# EAGLE design almost_smart_thermostat_v01 (EAGLE 8.7.0)
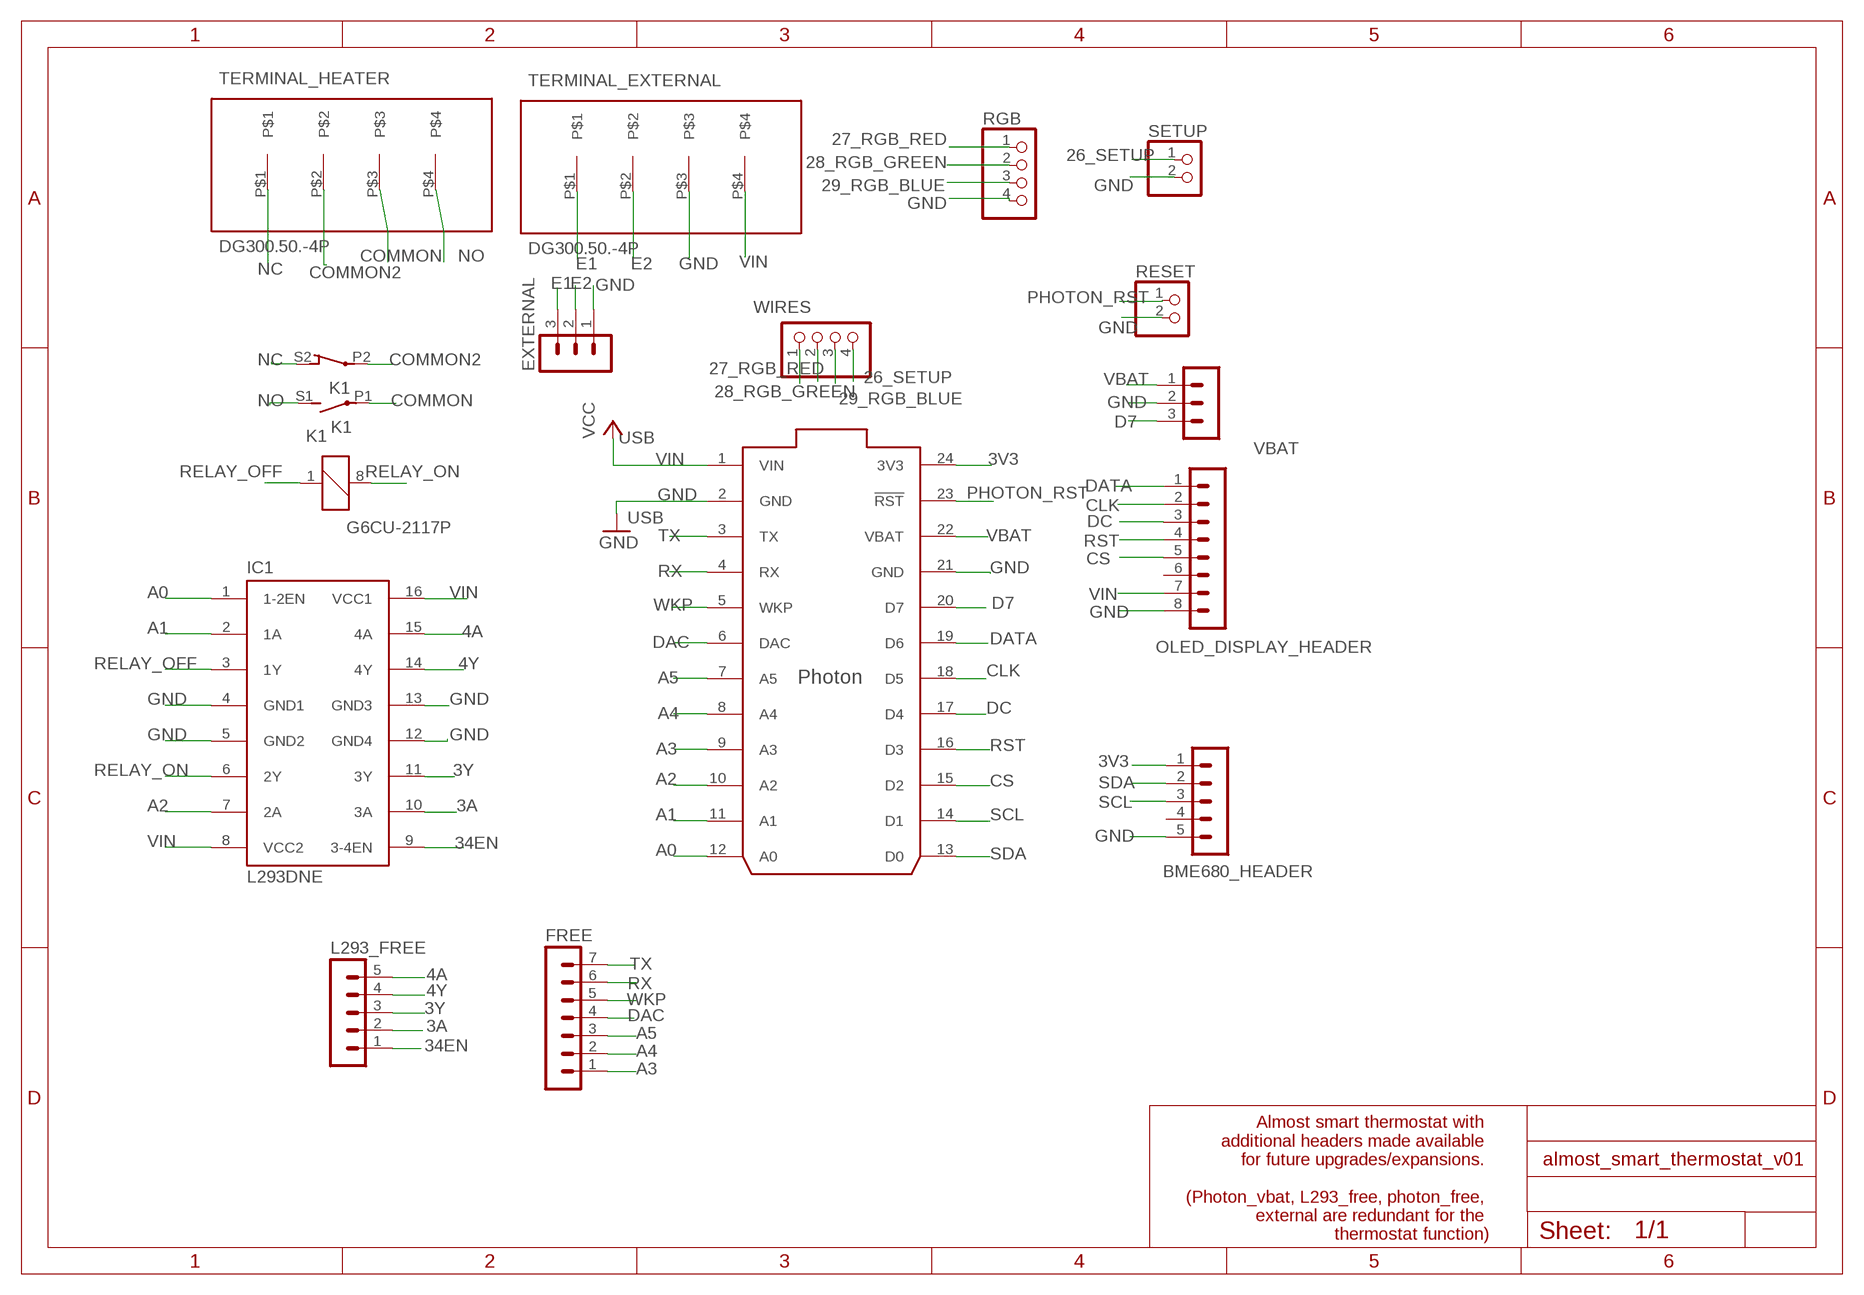
[diagram p0: schematic, sheet 1]

## Parts
BME680_HEADER  MA05-1  [MA05-1]
EXTERNAL  MA03-1  [MA03-1]
FREE  MA07-1  [MA07-1]
IC1  L293DNE  L293D  [DIL16]
K1  G6CU-2117P  G6C-2117P  [G6C-2117P]
L293_FREE  MA05-1  [MA05-1]
OLED_DISPLAY_HEADER  MA08-1  [MA08-1]
RESET  PINHD-1X2  [1X02]
RGB  PINHD-1X4  [1X04]
SETUP  PINHD-1X2  [1X02]
TERMINAL_EXTERNAL  DG300.50.-4P  [DG300-5.0-4P]
TERMINAL_HEATER  DG300.50.-4P  [DG300-5.0-4P]
U$1  PHOTON_WITH_HEADERS  [PHOTON]
VBAT  MA03-1  [MA03-1]
WIRES  PINHD-1X4  [1X04]

## Nets
3A: IC1.10(3A) L293_FREE.2
3V3: BME680_HEADER.1 U$1.24(3V3)
3Y: IC1.11(3Y) L293_FREE.3
4A: IC1.15(4A) L293_FREE.5
4Y: IC1.14(4Y) L293_FREE.4
26_SETUP: SETUP.1 WIRES.4
27_RGB_RED: RGB.1 WIRES.1
28_RGB_GREEN: RGB.2 WIRES.2
29_RGB_BLUE: RGB.3 WIRES.3
34EN: IC1.9(3-4EN) L293_FREE.1
A0: IC1.1(1-2EN) U$1.12(A0)
A1: IC1.2(1A) U$1.11(A1)
A2: IC1.7(2A) U$1.10(A2)
A3: FREE.1 U$1.9(A3)
A4: FREE.2 U$1.8(A4)
A5: FREE.3 U$1.7(A5)
CLK: OLED_DISPLAY_HEADER.2 U$1.18(D5)
COMMON: K1.P1(2:P) TERMINAL_HEATER.P$3
COMMON2: K1.P2(3:P) TERMINAL_HEATER.P$2
CS: OLED_DISPLAY_HEADER.5 U$1.15(D2)
D7: U$1.20(D7) VBAT.3
DAC: FREE.4 U$1.6(DAC)
DATA: OLED_DISPLAY_HEADER.1 U$1.19(D6)
DC: OLED_DISPLAY_HEADER.3 U$1.17(D4)
E1: EXTERNAL.3 TERMINAL_EXTERNAL.P$1
E2: EXTERNAL.2 TERMINAL_EXTERNAL.P$2
GND: BME680_HEADER.5 EXTERNAL.1 IC1.4(GND1) IC1.5(GND2) IC1.12(GND4) IC1.13(GND3) OLED_DISPLAY_HEADER.8 RESET.2 RGB.4 SETUP.2 TERMINAL_EXTERNAL.P$3 U$1.2(GND) U$1.21(GND) VBAT.2
NC: K1.S2(3:O) TERMINAL_HEATER.P$1
NO: K1.S1(2:S) TERMINAL_HEATER.P$4
PHOTON_RST: RESET.1 U$1.23(!RST)
RELAY_OFF: IC1.3(1Y) K1.1
RELAY_ON: IC1.6(2Y) K1.8
RST: OLED_DISPLAY_HEADER.4 U$1.16(D3)
RX: FREE.6 U$1.4(RX)
SCL: BME680_HEADER.3 U$1.14(D1)
SDA: BME680_HEADER.2 U$1.13(D0)
TX: FREE.7 U$1.3(TX)
VBAT: U$1.22(VBAT) VBAT.1
VIN: IC1.8(VCC2) IC1.16(VCC1) OLED_DISPLAY_HEADER.7 TERMINAL_EXTERNAL.P$4 U$1.1(VIN) ; supply symbol labelled VCC
WKP: FREE.5 U$1.5(WKP)
Unconnected: BME680_HEADER.4 OLED_DISPLAY_HEADER.6

## Notes on the sheet
- USB
- USB
- Almost smart thermostat with 
  additional headers made available 
  for future upgrades/expansions. 
  
  (Photon_vbat, L293_free, photon_free, 
  external are redundant for the 
  thermostat function)

## Library data of the parts
BME680_HEADER L293_FREE = con-lstb:MA05-1: PIN HEADER; OC_FARNELL: unknown; OC_NEWARK: unknown
EXTERNAL VBAT = con-lstb:MA03-1: PIN HEADER; OC_FARNELL: unknown; OC_NEWARK: unknown
FREE = con-lstb:MA07-1: PIN HEADER; OC_FARNELL: unknown; OC_NEWARK: unknown
IC1 = st-microelectronics:L293D: PUSH-PULL 4 CHANNEL DRIVER
K1 = relay:G6C-2117P: RELAY 1 x norm. open, 1x norm. closed, 10 A/240 V, Omron; OC_FARNELL: unknown; OC_NEWARK: unknown
OLED_DISPLAY_HEADER = con-lstb:MA08-1: PIN HEADER; OC_FARNELL: unknown; OC_NEWARK: unknown
RESET SETUP = pinhead:PINHD-1X2: PIN HEADER
RGB WIRES = pinhead:PINHD-1X4: PIN HEADER
TERMINAL_EXTERNAL TERMINAL_HEATER = heksalab:DG300.50.-4P: Degson Electronics PCB Terminal block
U$1 = Particle:PHOTON

## Board
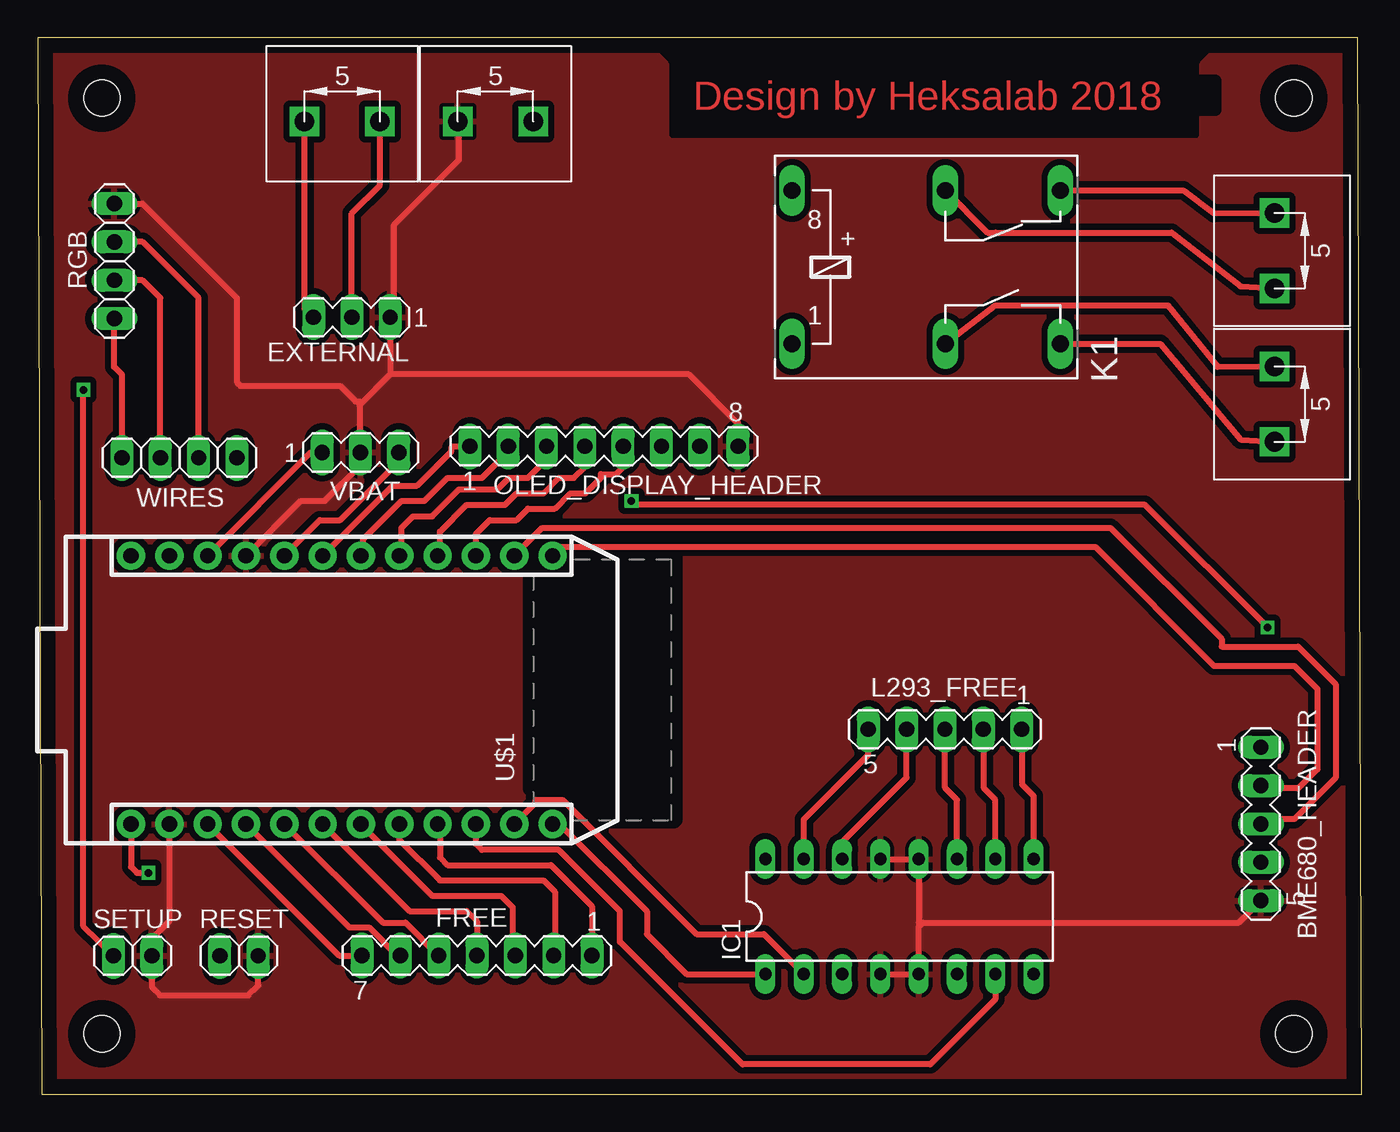
[diagram p1: board, top side]
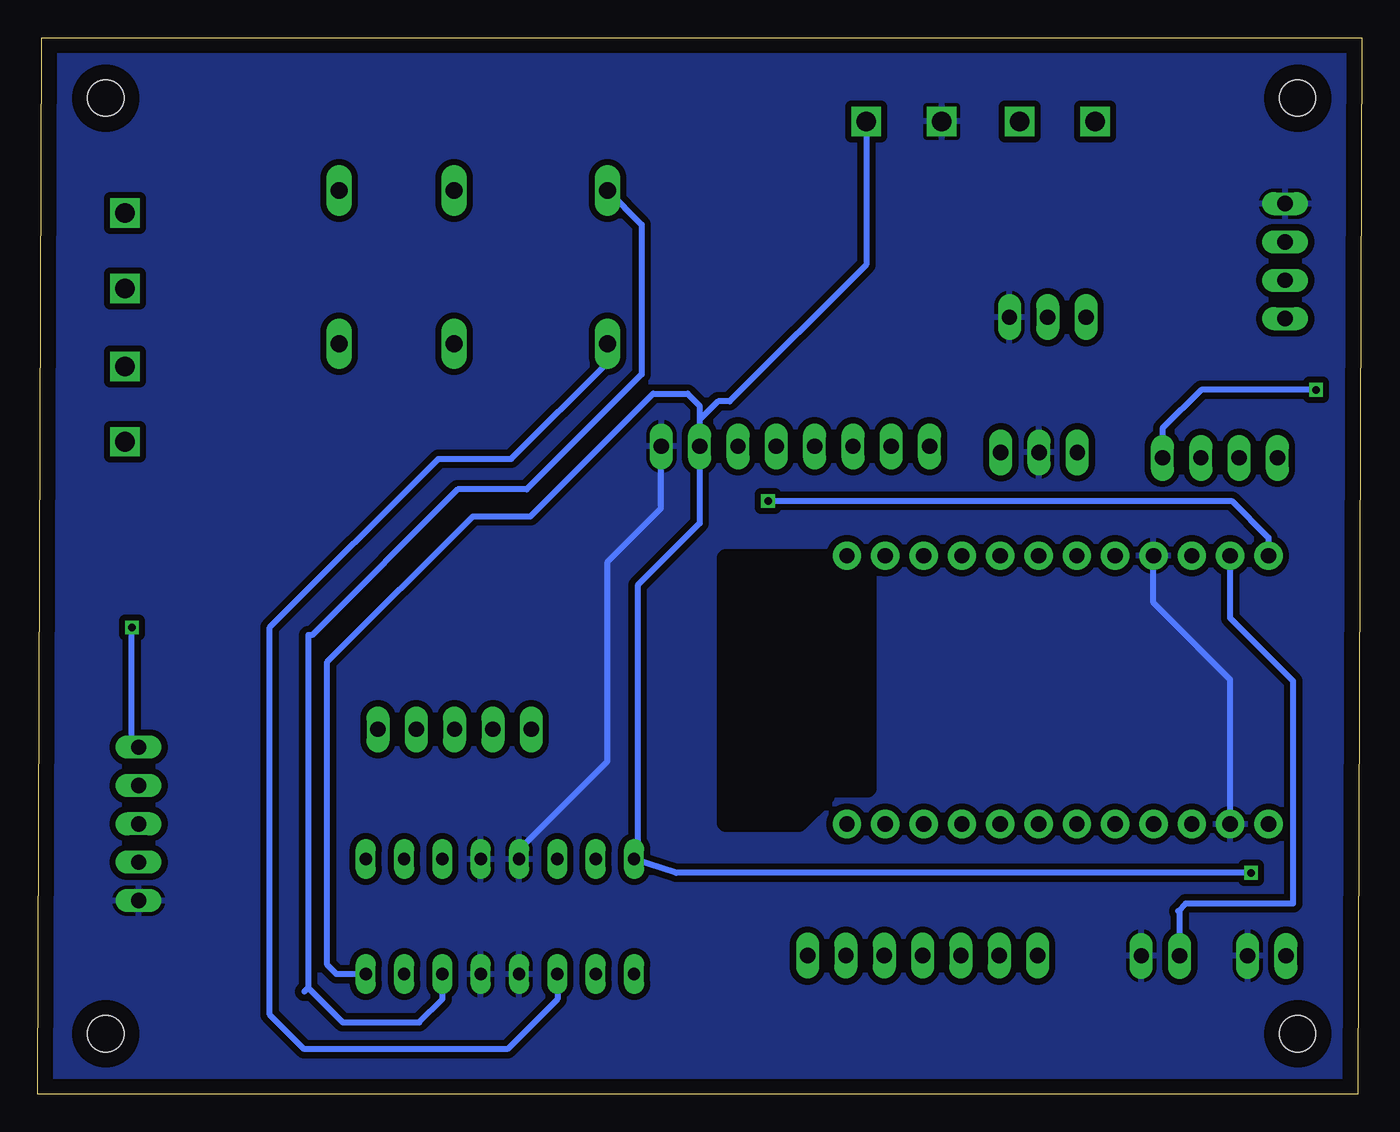
[diagram p2: board, bottom side, seen from below]

Size 87.76 x 70 mm. Coordinates in mm from the lower left corner, seen from the top.
Outline: 0.25,0 87.76,0 87.51,70 0,70 0.25,0
Copper layers (1*16): Top 0.035mm / dielectric 1.5mm / Bottom 0.035mm
Design rules "default": minimum track width 6mil, minimum drill 0.35mm, track to track 6mil, track to pad 6mil, pad to pad 6mil, via to via 6mil, smd to smd 6mil, copper to edge 40mil, drill to drill 6mil, minimum pad ring 10mil, minimum via ring 8mil, stop-mask expansion 4mil, vias tented up to drill 0mil, thermal gap 10mil
Holes 2.4 mm at 4.25,66 4.25,4 83.25,4 83.25,66
tRestrict: area 32.8,18 to 42.1,35.5
bRestrict: area 32.8,18 to 42.1,35.5

### Footprints (pad centres in the part's own frame; a part is rotated, then mirrored left to right if it is on the bottom)
MA05-1 = drill 1.016 long: 1 -5.08,0; 2 -2.54,0; 3 0,0; 4 2.54,0; 5 5.08,0
MA03-1 = drill 1.016 long: 1 -2.54,0; 2 0,0; 3 2.54,0
MA07-1 = drill 1.016 long: 1 -7.62,0; 2 -5.08,0; 3 -2.54,0; 4 0,0; 5 2.54,0; 6 5.08,0; 7 7.62,0
DIL16 = drill 0.813 long: 1 -8.89,-3.81; 2 -6.35,-3.81; 3 -3.81,-3.81; 4 -1.27,-3.81; 5 1.27,-3.81; 6 3.81,-3.81; 7 6.35,-3.81; 8 8.89,-3.81; 9 8.89,3.81; 10 6.35,3.81; 11 3.81,3.81; 12 1.27,3.81; 13 -1.27,3.81; 14 -3.81,3.81; 15 -6.35,3.81; 16 -8.89,3.81
G6C-2117P = drill 1.118 long: 1 -8.89,-5.08; 8 -8.89,5.08; P1 1.27,-5.08; P2 1.27,5.08; S1 8.89,-5.08; S2 8.89,5.08
MA08-1 = drill 1.016 long: 1 -8.89,0; 2 -6.35,0; 3 -3.81,0; 4 -1.27,0; 5 1.27,0; 6 3.81,0; 7 6.35,0; 8 8.89,0
1X02 = drill 1.016 long: 1 -1.27,0; 2 1.27,0
1X04 = drill 1.016 long: 1 -3.81,0; 2 -1.27,0; 3 1.27,0; 4 3.81,0
DG300-5.0-4P = drill 1.3 square: P$1 -6.31,1.5; P$2 -1.31,1.5; P$3 3.85,1.5; P$4 8.85,1.5
PHOTON = drill 1.016 pad 1.88: 1 1.27,32.258; 2 1.27,29.718; 3 1.27,27.178; 4 1.27,24.638; 5 1.27,22.098; 6 1.27,19.558; 7 1.27,17.018; 8 1.27,14.478; 9 1.27,11.938; 10 1.27,9.398; 11 1.27,6.858; 12 1.27,4.318; 13 19.05,4.318; 14 19.05,6.858; 15 19.05,9.398; 16 19.05,11.938; 17 19.05,14.478; 18 19.05,17.018; 19 19.05,19.558; 20 19.05,22.098; 21 19.05,24.638; 22 19.05,27.178; 23 19.05,29.718; 24 19.05,32.258

### Placement (x,y rotation side)
BME680_HEADER  81.07,17.91 270 top
EXTERNAL  20.81,51.48 180 top
FREE  29.11,9.18 180 top
IC1  57.12,11.77 0 top
K1  58.88,54.8 0 top
L293_FREE  60.13,24.18 180 top
OLED_DISPLAY_HEADER  37.53,42.93 0 top
RESET  13.34,9.17 0 top
RGB  5.08,55.2 90 top
SETUP  6.29,9.17 0 top
TERMINAL_EXTERNAL  23.99,62.96 0 top
TERMINAL_HEATER  80.47,52.08 270 top
U$1  38.44,16.63 90 top
VBAT  21.39,42.52 0 top
WIRES  9.39,42.17 0 top

### Tracks (layer width: path | path; a pad name or v marks a point on that pad's centre or on a via)
3A
  Top 0.406: IC1.10 63.47,19.5 62.72,20.26 62.72,24.13 L293_FREE.2
3V3  (via drill 0.5)
  Top 0.406: v81.52,30.92 73.39,39.05 39.61,39.05 v39.35,39.31
  Bottom 0.406: BME680_HEADER.1 81.52,23.43 v81.52,30.92 | v39.35,39.31 8.62,39.31 6.19,36.87 U$1.24
3Y
  Top 0.406: IC1.11 60.93,19.5 60.13,20.3 L293_FREE.3
4A
  Top 0.406: IC1.15 50.77,18.21 55.05,22.49 L293_FREE.5
4Y
  Top 0.406: IC1.14 53.31,16.69 57.59,20.97 L293_FREE.4
26_SETUP  (via drill 0.5)
  Top 0.406: SETUP.1 3.03,11.11 v3.03,46.67
  Bottom 0.406: v3.03,46.67 10.65,46.67 13.2,44.12 WIRES.4
27_RGB_RED
  Top 0.406: WIRES.1 5.58,47.68 5.06,48.2 5.06,51.37 RGB.1
28_RGB_GREEN
  Top 0.406: WIRES.2 8.12,52.76 6.95,53.93 RGB.2
29_RGB_BLUE
  Top 0.406: WIRES.3 10.66,52.76 6.95,56.47 RGB.3
34EN
  Top 0.406: IC1.9 66.01,19.76 65.26,20.51 65.26,24.13 L293_FREE.1
A0
  Top 0.406: U$1.12 34.6,17.9 40.37,12.13 40.37,10.6 43.01,7.96 IC1.1
A1
  Top 0.406: U$1.11 33,19.32 33,19.49 34.78,19.49 43.67,10.6 48.13,10.6 IC1.2
A2
  Top 0.406: IC1.7 63.47,6.28 59.17,1.97 46.72,1.97 38.59,10.1 38.59,12.13 34.53,16.19 29.45,16.19 29.05,16.59 U$1.10
A3
  Top 0.406: U$1.9 26.65,17.75 26.65,15.68 27.16,15.18 34.02,15.18 36.73,12.46 FREE.1
A4
  Top 0.406: 24.11,17.75 U$1.8 23.97,16.85 26.65,14.16 33.51,14.16 34.27,13.4 34.27,9.26 FREE.2
A5
  Top 0.406: 21.57,17.75 U$1.7 21.43,17.86 26.15,13.14 30.72,13.14 31.48,12.38 31.48,9.35 FREE.3
CLK
  Top 0.406: U$1.18 21.57,35.83 21.57,36.77 24.11,39.31 25.64,39.31 27.16,40.83 29.45,40.83 31.18,42.57 OLED_DISPLAY_HEADER.2
COMMON
  Top 0.406: K1.P1 63.48,52.26 74.91,52.26 78.22,48.2 TERMINAL_HEATER.P$3
COMMON2
  Top 0.406: TERMINAL_HEATER.P$2 79.74,53.53 75.17,57.09 63.48,57.09 62.98,57.09 62.95,57.09 K1.P2
CS
  Top 0.406: U$1.15 29.05,37.13 29.96,38.04 31.73,38.04 32.5,38.8 34.27,38.8 35.29,39.81 36.31,39.81 37.32,40.83 37.32,41.08 38.34,41.08 38.8,41.55 OLED_DISPLAY_HEADER.5
D7
  Top 0.406: U$1.20 18.7,38.04 20.05,38.04 24.37,42.35 24.2,42.52 VBAT.3
DAC
  Top 0.406: U$1.6 24.66,12.13 28.43,12.13 29.11,11.45 FREE.4
DATA
  Top 0.406: U$1.19 23.53,40.32 25.13,40.32 27.42,42.61 27.42,42.86 27.48,42.93 OLED_DISPLAY_HEADER.1
DC
  Top 0.406: U$1.17 24.11,35.83 24.11,37.53 24.88,38.29 26.15,38.29 27.92,40.07 30.46,40.07 31.23,40.83 32.5,40.83 33.77,42.1 33.77,42.89 OLED_DISPLAY_HEADER.3
E1
  Top 0.406: EXTERNAL.3 17.68,52.07 TERMINAL_EXTERNAL.P$1
E2
  Top 0.406: EXTERNAL.2 20.81,58.36 22.68,60.23 TERMINAL_EXTERNAL.P$2
GND
  Top 0.406: U$1.2 8.73,11.47 7.56,10.31 | 7.56,10.31 7.35,10.1 | RESET.2 14.61,7.2 13.95,6.54 8.11,6.54 7.56,7.09 SETUP.2 7.56,10.31 | U$1.21 17.43,39.31 19.03,39.31 21.39,41.67 VBAT.2 21.32,42.59 21.32,45.66 | RGB.4 6.95,59.01 13.19,52.77 13.19,47.18 13.45,46.93 20.05,46.93 21.07,45.91 21.32,45.91 21.32,45.66 | 23.35,47.69 EXTERNAL.1 23.61,51.73 23.61,57.59 27.92,61.91 27.92,64.38 TERMINAL_EXTERNAL.P$3 | 23.35,47.69 21.32,45.66 | OLED_DISPLAY_HEADER.8 46.42,44.43 43.16,47.69 23.35,47.69 | IC1.4 IC1.5 58.39,11.1 58.53,11.24 | 58.53,11.24 58.66,11.37 79.61,11.37 BME680_HEADER.5 | IC1.13 IC1.12 58.39,11.38 58.53,11.24
  Bottom 0.406: OLED_DISPLAY_HEADER.8 46.47,42.89 46.47,38.8 50.02,35.24 50.02,22.03 55.86,16.19 56.12,16.19 56.12,15.84 IC1.13 | U$1.2 8.73,27.47 13.81,32.55 U$1.21
  pour Top (isolate 0.406): 0.24,70.04 39.86,70.04 41.64,68.26 41.64,63.44 41.89,63.18 76.95,63.18 77.2,63.44 77.2,68.26 78.98,70.04 87.11,70.04 87.36,69.79 87.36,-0.06 0.24,-0.06
  pour Bottom (isolate 0.406): 0.24,70.04 87.36,70.04 87.36,0.19 87.11,-0.06 0.49,-0.06 0.24,0.19
NC
  Top 0.406: K1.S2 75.93,59.88 77.96,58.36 TERMINAL_HEATER.P$1
NO
  Top 0.406: K1.S1 74.41,49.72 79.74,43.37 TERMINAL_HEATER.P$4
PHOTON_RST
  Bottom 0.406: RESET.1 12.07,12.03 12.18,12.13 11.67,12.64 4.56,12.64 4.56,27.37 8.73,31.54 U$1.23
RELAY_OFF
  Bottom 0.406: IC1.3 53.31,6.3 56.63,2.98 70.09,2.98 72.37,5.27 72.37,30.92 61.2,42.1 56.37,42.1 49.99,48.48 K1.1
RELAY_ON
  Bottom 0.406: K1.8 47.74,57.62 47.74,47.69 55.36,40.07 59.93,40.07 69.58,30.42 69.83,30.42 69.83,7.05 | 70.09,6.79 69.83,7.05 | 69.83,7.05 67.55,4.76 62.47,4.76 60.93,6.3 IC1.6
RST
  Top 0.406: U$1.16 26.65,35.83 26.65,37.27 28.43,39.05 30.97,39.05 31.73,39.81 33.51,39.81 34.53,40.83 35.54,40.83 36.26,41.55 OLED_DISPLAY_HEADER.4
RX
  Top 0.406: U$1.4 20.65,11.06 21.96,11.06 23.84,9.18 FREE.6
SCL
  Top 0.406: U$1.14 33.43,37.53 71.1,37.53 78.47,30.16 78.47,29.65 83.55,29.65 86.04,27.17 86.04,20.96 83.3,18.22 81.52,18.22 81.2,17.91 BME680_HEADER.3
SDA
  Top 0.406: U$1.13 34.7,36.26 70.09,36.26 77.96,28.38 83.3,28.38 84.82,26.86 84.82,21.53 83.55,20.26 81.27,20.26 BME680_HEADER.2
TX
  Top 0.406: U$1.3 19.99,9.18 FREE.7
VBAT
  Top 0.406: U$1.22 18.11,42.52 VBAT.1
VIN  (via drill 0.5)
  Top 0.406: U$1.1 6.19,15.07 6.59,14.67 v7.35,14.67
  Bottom 0.406: v7.35,14.67 45.45,14.67 IC1.16 47.99,15.82 47.99,33.72 43.88,37.82 OLED_DISPLAY_HEADER.7 | TERMINAL_EXTERNAL.P$4 32.84,54.96 41.89,45.91 42.66,45.91 43.88,44.68 OLED_DISPLAY_HEADER.7 | IC1.8 67.95,7.96 68.56,8.57 68.56,28.64 58.91,38.29 55.1,38.29 46.97,46.42 44.69,46.42 43.88,45.61 OLED_DISPLAY_HEADER.7
WKP
  Top 0.406: U$1.5 22.88,11.37 24.37,11.37 26.55,9.18 FREE.5

### Text on the board
Top: Design by Heksalab 2018
tDocu: GND | GND | E1 | E2 | NC | VIN | BLUE | GREEN | E1 | E2 | GND | common | RED | common | blue | vbat | GND | D7 | DATA | CLK | DC | RST | CS | VIN | GND | GND | green | setup | NO | 3V3 | SDA | 4A | 4Y | 3Y | 3A | 34EN | VIN | GND | SCL | VIN | GND | GND | GND | VIN | TX | RX | DAC | A5 | A4 | A3 | GND | WKP